# EAGLE design W026X (EAGLE 6.6.0)
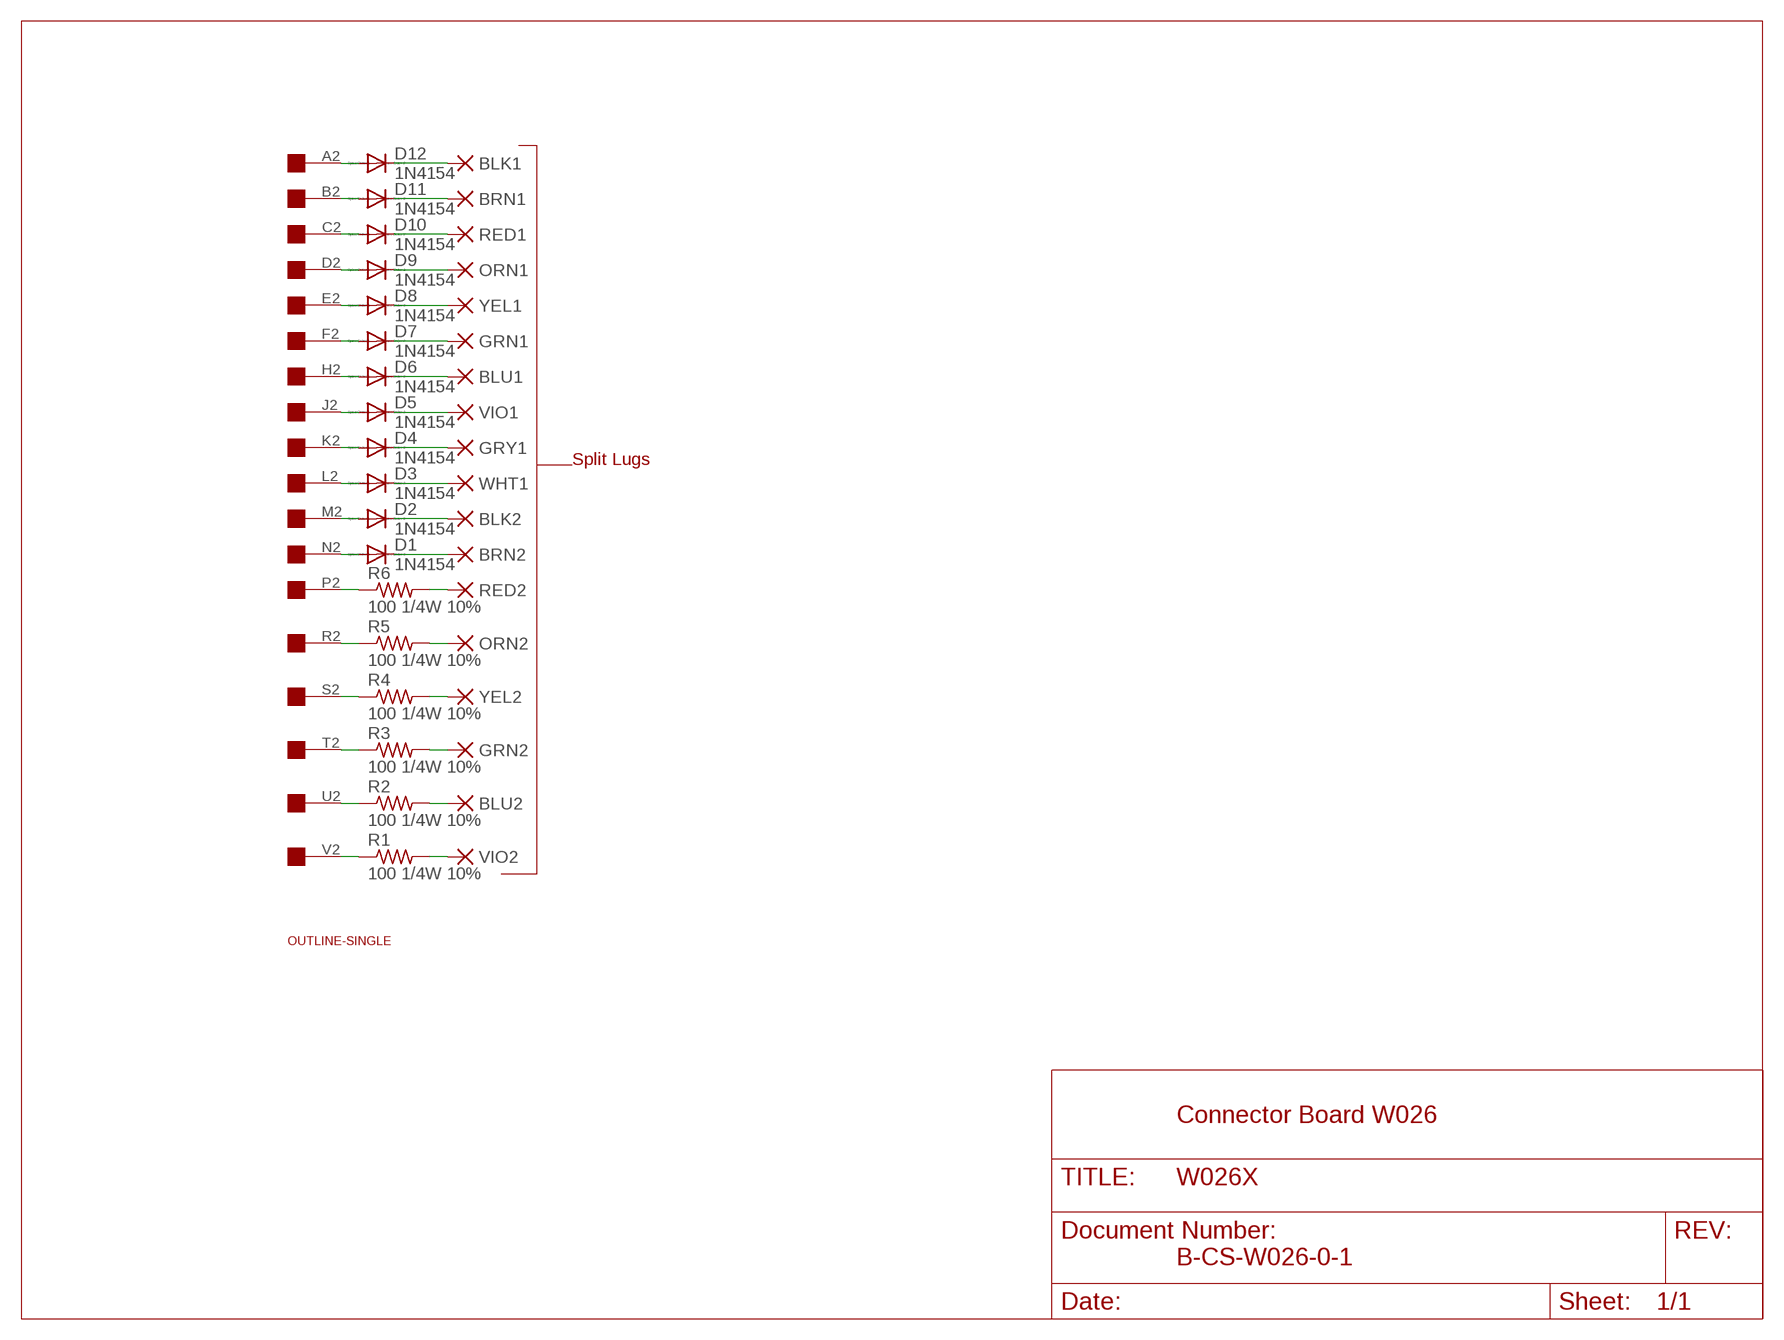
[diagram p0: schematic, sheet 1]

## Parts
BLK1  PAD-0465  [0465]
BLK2  PAD-0465  [0465]
BLU1  PAD-0465  [0465]
BLU2  PAD-0465  [0465]
BRN1  PAD-0465  [0465]
BRN2  PAD-0465  [0465]
D1  1N4154  1N4148DO35-10  [DO35-10]
D2  1N4154  1N4148DO35-10  [DO35-10]
D3  1N4154  1N4148DO35-10  [DO35-10]
D4  1N4154  1N4148DO35-10  [DO35-10]
D5  1N4154  1N4148DO35-10  [DO35-10]
D6  1N4154  1N4148DO35-10  [DO35-10]
D7  1N4154  1N4148DO35-10  [DO35-10]
D8  1N4154  1N4148DO35-10  [DO35-10]
D9  1N4154  1N4148DO35-10  [DO35-10]
D10  1N4154  1N4148DO35-10  [DO35-10]
D11  1N4154  1N4148DO35-10  [DO35-10]
D12  1N4154  1N4148DO35-10  [DO35-10]
GRN1  PAD-0465  [0465]
GRN2  PAD-0465  [0465]
GRY1  PAD-0465  [0465]
ORN1  PAD-0465  [0465]
ORN2  PAD-0465  [0465]
R1  100 1/4W 10%  R-US_0207/10  [0207/10]
R2  100 1/4W 10%  R-US_0207/10  [0207/10]
R3  100 1/4W 10%  R-US_0207/10  [0207/10]
R4  100 1/4W 10%  R-US_0207/10  [0207/10]
R5  100 1/4W 10%  R-US_0207/10  [0207/10]
R6  100 1/4W 10%  R-US_0207/10  [0207/10]
RED1  PAD-0465  [0465]
RED2  PAD-0465  [0465]
U$1  OUTLINE-SINGLE  [SINGLE]
U$2  EDGE-1  [EDGE-CON1]
VIO1  PAD-0465  [0465]
VIO2  PAD-0465  [0465]
WHT1  PAD-0465  [0465]
YEL1  PAD-0465  [0465]
YEL2  PAD-0465  [0465]

## Nets
N$1 [Supply]: D10.C RED1.P$1(P)
N$2 [Supply]: D7.C GRN1.P$1(P)
N$3 [Supply]: D5.C VIO1.P$1(P)
N$4 [Supply]: D3.C WHT1.P$1(P)
N$5 [Supply]: BRN2.P$1(P) D1.C
N$6 [Supply]: ORN2.P$1(P) R5.2
N$7 [Supply]: GRN2.P$1(P) R3.2
N$8 [Supply]: R1.2 VIO2.P$1(P)
N$9: BRN1.P$1(P) D11.C
N$10 [Supply]: BLK1.P$1(P) D12.C
N$11 [Supply]: D1.A U$2.N2
N$12 [Supply]: D8.C YEL1.P$1(P)
N$13 [Supply]: BLU1.P$1(P) D6.C
N$14 [Supply]: D4.C GRY1.P$1(P)
N$15: D9.C ORN1.P$1(P)
N$16 [Supply]: BLU2.P$1(P) R2.2
N$17 [Supply]: R4.2 YEL2.P$1(P)
N$18 [Supply]: R6.2 RED2.P$1(P)
N$19 [Supply]: BLK2.P$1(P) D2.C
N$20: D11.A U$2.B2
N$21 [Supply]: D12.A U$2.A2
N$22 [Supply]: D2.A U$2.M2
N$23 [Supply]: D3.A U$2.L2
N$24 [Supply]: D4.A U$2.K2
N$25 [Supply]: D5.A U$2.J2
N$26 [Supply]: D6.A U$2.H2
N$27 [Supply]: D7.A U$2.F2
N$28 [Supply]: D8.A U$2.E2
N$29: D9.A U$2.D2
N$30 [Supply]: D10.A U$2.C2
N$31 [Supply]: R6.1 U$2.P2
N$32 [Supply]: R1.1 U$2.V2
N$33 [Supply]: R2.1 U$2.U2
N$34 [Supply]: R3.1 U$2.T2
N$35 [Supply]: R4.1 U$2.S2
N$36 [Supply]: R5.1 U$2.R2

## Notes on the sheet
- Split Lugs
- Connector Board W026
- B-CS-W026-0-1

## Library data of the parts
BLK1 BLK2 BLU1 BLU2 BRN1 BRN2 GRN1 GRN2 GRY1 ORN1 ORN2 RED1 RED2 VIO1 VIO2 WHT1 YEL1 YEL2 = dec-con:PAD: WIRE PAD Standard US Drill Sizes
D1-D12 = diode:1N4148: DIODE high speed (Philips)
R1-R6 = rcl:R-US_: RESISTOR, American symbol
U$1 = dec-con:OUTLINE-*: Board outlines for DEC boards.
U$2 = dec-con:EDGE-1: Single-Sided DEC Edge Connector -- (side 2)

## Net classes
1 Supply: width 0.813 mm

## Board
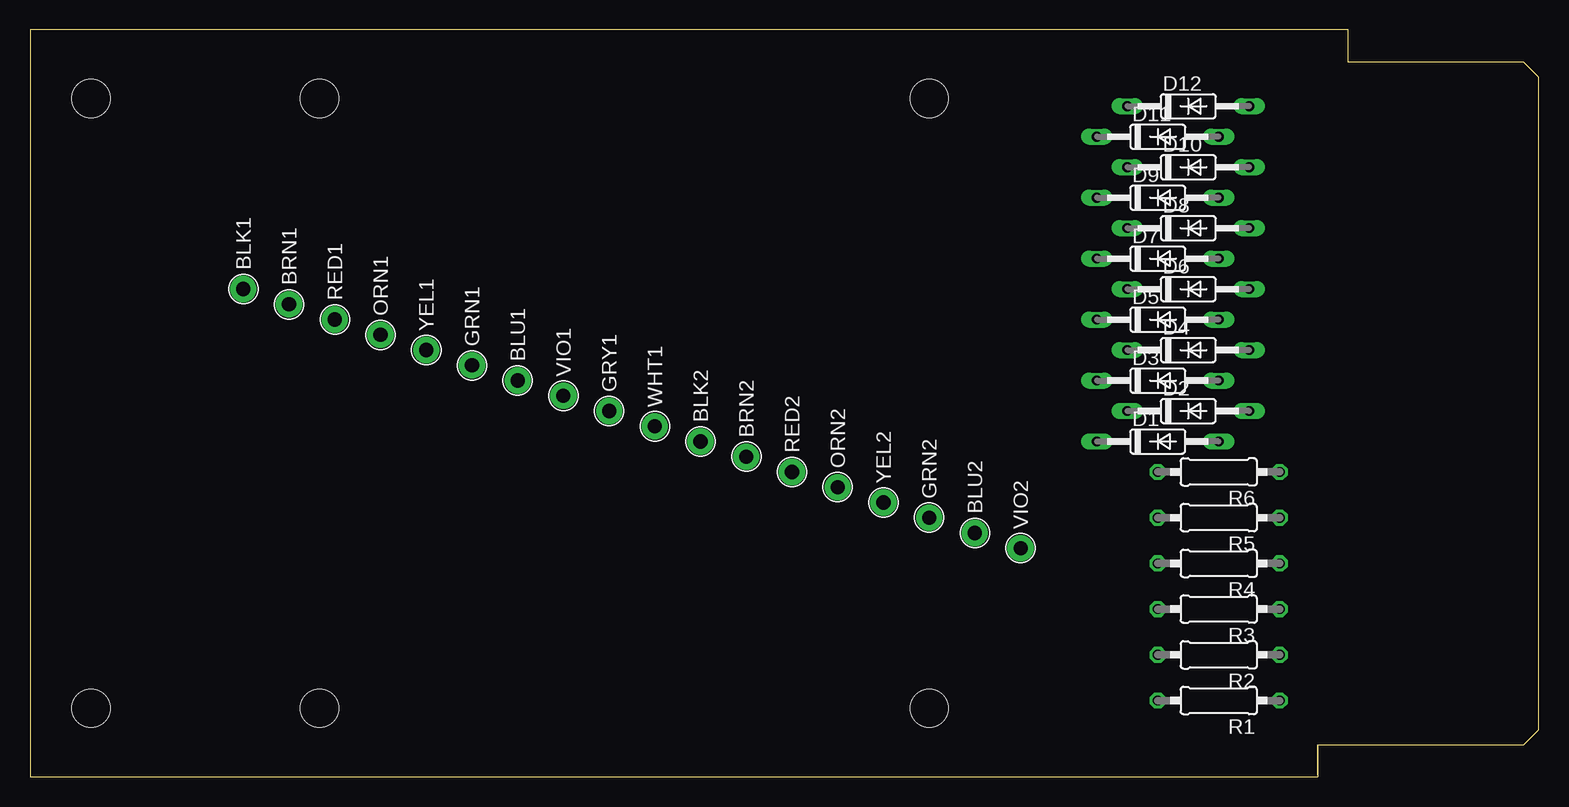
[diagram p1: board, top side]
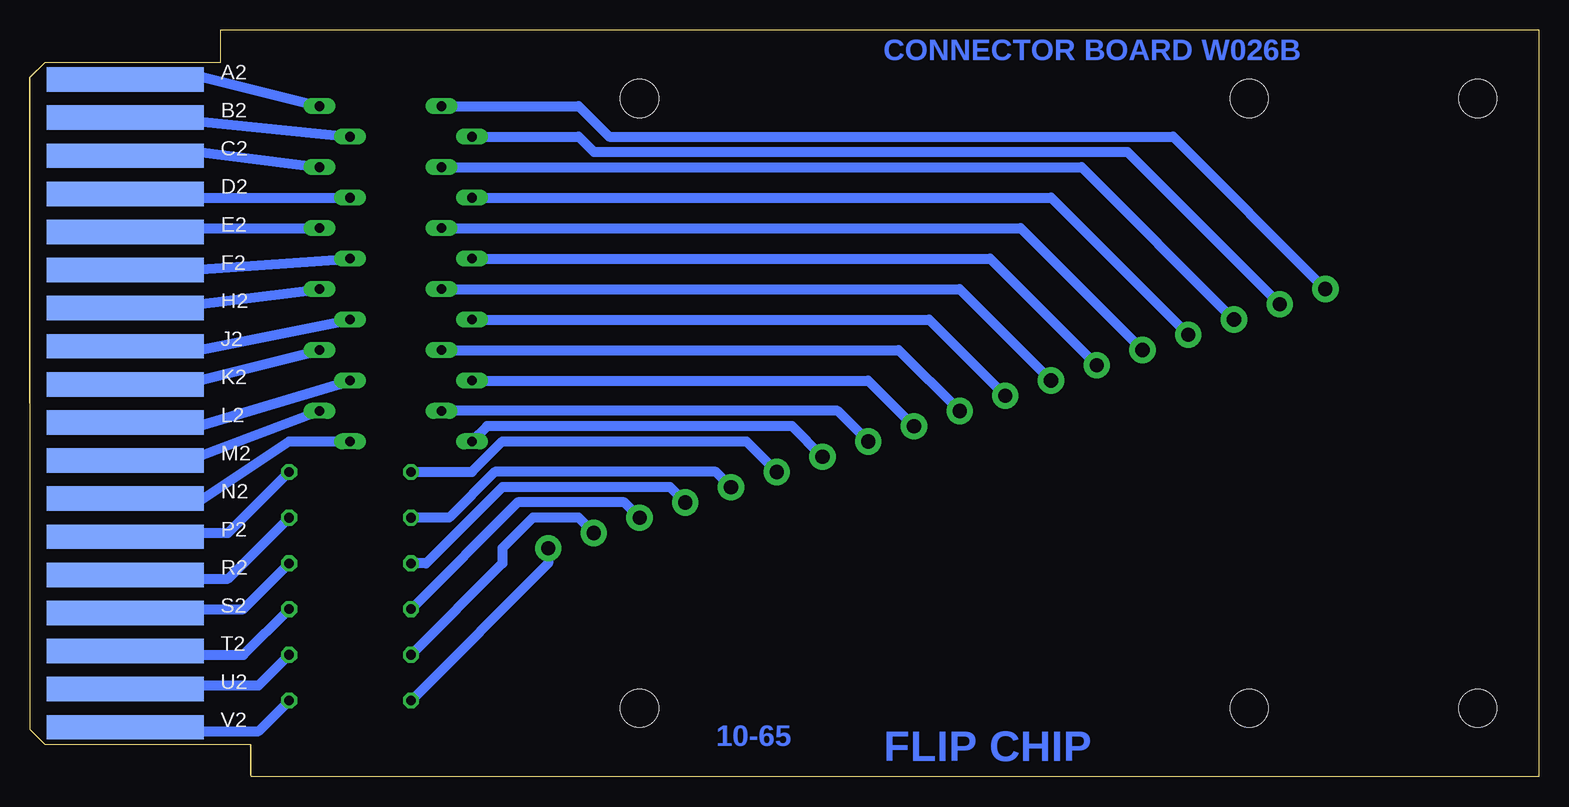
[diagram p2: board, bottom side, seen from below]

Size 125.73 x 62.23 mm. Coordinates in mm from the lower left corner, seen from the top.
Copper layers (1+16): Top 0.035mm / dielectric 1.5mm / Bottom 0.035mm
Design rules "16mils": minimum track width 16mil, minimum drill 32mil, track to track 15mil, track to pad 10mil, pad to pad 10mil, via to via 10mil, smd to smd 10mil, copper to edge 13mil, drill to drill 10mil, minimum pad ring 10mil, minimum via ring 8mil, stop-mask expansion 0mil, vias tented up to drill 0mil, thermal gap 10mil
Holes 3.17 mm at 24.13,56.52 24.13,5.71 74.93,56.52 74.93,5.71

### Footprints (pad centres in the part's own frame; a part is rotated, then mirrored left to right if it is on the bottom)
0465 = drill 1.181 pad 2.184: P$1 0,0
DO35-10 = drill 0.813 long: A 5.08,0; C -5.08,0
0207/10 = drill 0.813 octagon: 1 -5.08,0; 2 5.08,0
SINGLE = hole 3.175: 120.65,56.515; 120.65,5.715
EDGE-CON1 = smd 13.106 x 2.032 bottom: A2 7.938,4.128; B2 7.938,7.303; C2 7.938,10.477; D2 7.938,13.652; E2 7.938,16.828; F2 7.938,20.003; H2 7.938,23.177; J2 7.938,26.352; K2 7.938,29.527; L2 7.938,32.703; M2 7.938,35.877; N2 7.938,39.053; P2 7.938,42.227; R2 7.938,45.403; S2 7.938,48.578; T2 7.938,51.752; U2 7.938,54.928; V2 7.938,58.102

### Placement (x,y rotation side)
BLK1  17.78,40.64 90 top
BLK2  55.88,27.94 90 top
BLU1  40.64,33.02 90 top
BLU2  78.74,20.32 90 top
BRN1  21.59,39.37 90 top
BRN2  59.69,26.67 90 top
D1  93.98,27.94 0 top
D2  96.52,30.48 0 top
D3  93.98,33.02 0 top
D4  96.52,35.56 0 top
D5  93.98,38.1 0 top
D6  96.52,40.64 0 top
D7  93.98,43.18 0 top
D8  96.52,45.72 0 top
D9  93.98,48.26 0 top
D10  96.52,50.8 0 top
D11  93.98,53.34 0 top
D12  96.52,55.88 0 top
GRN1  36.83,34.29 90 top
GRN2  74.93,21.59 90 top
GRY1  48.26,30.48 90 top
ORN1  29.21,36.83 90 top
ORN2  67.31,24.13 90 top
R1  99.06,6.35 180 top
R2  99.06,10.16 180 top
R3  99.06,13.97 180 top
R4  99.06,17.78 180 top
R5  99.06,21.59 180 top
R6  99.06,25.4 180 top
RED1  25.4,38.1 90 top
RED2  63.5,25.4 90 top
U$1  125.73,62.23 180 top
U$2  125.73,62.23 180 top
VIO1  44.45,31.75 90 top
VIO2  82.55,19.05 90 top
WHT1  52.07,29.21 90 top
YEL1  33.02,35.56 90 top
YEL2  71.12,22.86 90 top

### Tracks (layer width: path | path; a pad name or v marks a point on that pad's centre or on a via)
N$1
  Bottom 0.813: D10.C 38.1,50.8 RED1.P$1
N$2
  Bottom 0.813: D7.C 45.72,43.18 GRN1.P$1
N$3
  Bottom 0.813: D5.C 50.8,38.1 VIO1.P$1
N$4
  Bottom 0.813: D3.C 55.88,33.02 WHT1.P$1
N$5
  Bottom 0.813: BRN2.P$1 62.23,29.21 87.63,29.21 D1.C
N$6
  Bottom 0.813: ORN2.P$1 68.58,25.4 87,25.4 90.81,21.59 R5.2
N$7
  Bottom 0.813: GRN2.P$1 76.2,22.86 85.09,22.86 R3.2
N$8
  Bottom 0.813: VIO2.P$1 82.55,17.78 R1.2
N$9
  Bottom 0.813: D11.C 80.01,53.34 78.74,52.07 34.29,52.07 BRN1.P$1
N$10
  Bottom 0.813: D12.C 80.01,55.88 77.47,53.34 30.48,53.34 BLK1.P$1
N$11
  Bottom 0.813: U$2.N2 116.84,22.86 111.76,22.86 104.14,27.94 D1.A
N$12
  Bottom 0.813: D8.C 43.18,45.72 YEL1.P$1
N$13
  Bottom 0.813: D6.C 48.26,40.64 BLU1.P$1
N$14
  Bottom 0.813: D4.C 53.34,35.56 GRY1.P$1
N$15
  Bottom 0.813: D9.C 40.64,48.26 ORN1.P$1
N$16
  Bottom 0.813: BLU2.P$1 80.01,21.59 83.82,21.59 86.36,19.05 86.36,17.78 R2.2
N$17
  Bottom 0.813: YEL2.P$1 72.39,24.13 86.36,24.13 92.71,17.78 R4.2
N$18
  Bottom 0.813: R6.2 88.9,25.4 86.36,27.94 66.04,27.94 RED2.P$1
N$19
  Bottom 0.813: BLK2.P$1 58.42,30.48 D2.C
N$20
  Bottom 0.813: U$2.B2 116.84,54.61 111.76,54.61 D11.A
N$21
  Bottom 0.813: U$2.A2 116.84,58.04 116.84,58.42 111.76,58.42 D12.A
N$22
  Bottom 0.813: U$2.M2 116.84,26.67 111.76,26.67 D2.A
N$23
  Bottom 0.813: U$2.L2 116.84,29.21 111.76,29.21 D3.A
N$24
  Bottom 0.813: U$2.K2 116.84,33.02 111.76,33.02 D4.A
N$25
  Bottom 0.813: U$2.J2 116.84,35.56 111.76,35.56 D5.A
N$26
  Bottom 0.813: U$2.H2 116.84,39.37 111.76,39.37 D6.A
N$27
  Bottom 0.813: U$2.F2 116.84,41.91 D7.A
N$28
  Bottom 0.813: U$2.E2 116.84,45.72 D8.A
N$29
  Bottom 0.813: U$2.D2 116.84,48.26 D9.A
N$30
  Bottom 0.813: U$2.C2 116.84,52.07 111.76,52.07 D10.A
N$31
  Bottom 0.813: U$2.P2 116.84,20.32 109.22,20.32 R6.1
N$32
  Bottom 0.813: U$2.V2 117.16,4.13 116.84,3.81 106.68,3.81 R1.1
N$33
  Bottom 0.813: U$2.U2 117.2,7.26 116.84,7.62 106.68,7.62 R2.1
N$34
  Bottom 0.813: U$2.T2 117.17,10.49 116.84,10.16 107.95,10.16 R3.1
N$35
  Bottom 0.813: U$2.S2 117.14,13.66 116.84,13.97 107.95,13.97 R4.1
N$36
  Bottom 0.813: U$2.R2 117.17,16.84 116.84,16.51 109.22,16.51 R5.1

### Text on the board
Bottom: CONNECTOR BOARD W026B | 10-65 | FLIP CHIP
200bmp: C:/Users/Vince/Documents/websvn/trunk/Eagle/projects/DEC/Wxxx/W026/W026Bbackfb.bmp